# Altium schematic sheet SOM_BOOT.SchDoc
size 420 x 297 mm; SheetNumber: 8; SheetTotal: 19
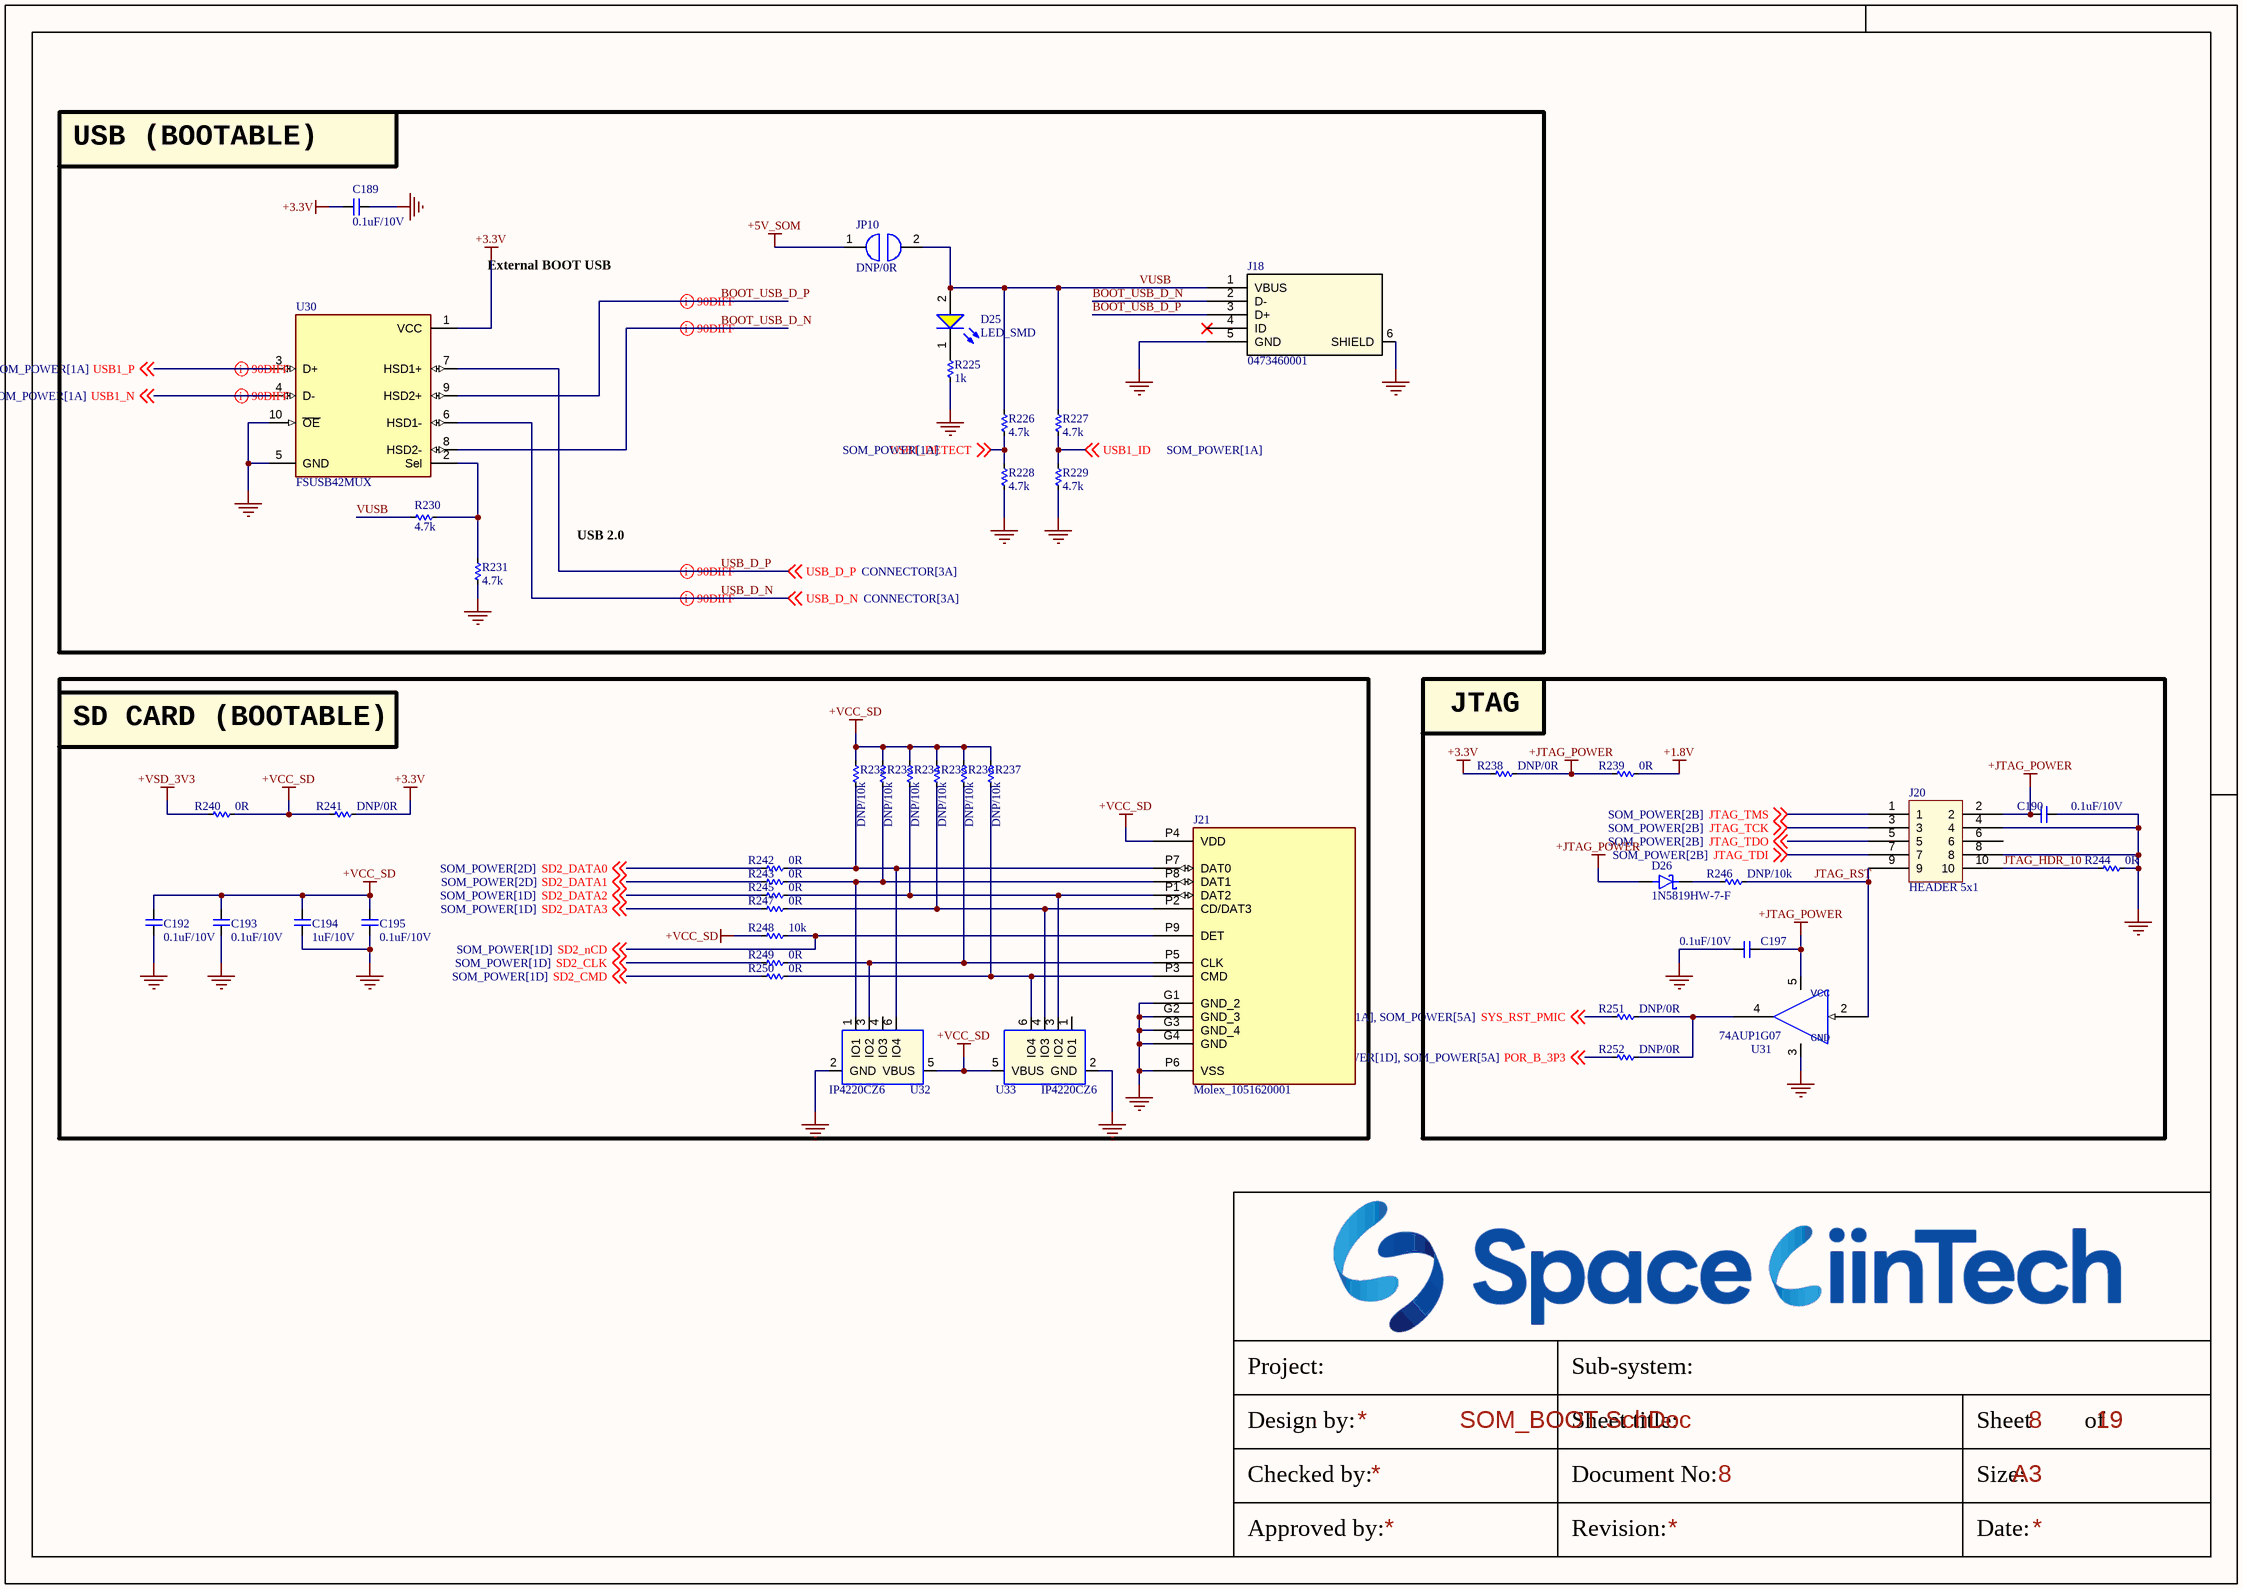
[diagram p0: SOM_BOOT.SchDoc]

## Parts
C189  0.1uF/10V  [CAP_C_1005X60]
C190  0.1uF/10V  [CAP_C_1005X60]
C192  0.1uF/10V  [CAP_C_1005X60]
C193  0.1uF/10V  [CAP_C_1005X60]
C194  1uF/10V  [CAP_C_1005X60]
C195  0.1uF/10V  [CAP_C_1005X60]
C197  0.1uF/10V  [CAP_C_1005X60]
D25  LED_SMD  [LED_0603]
D26  1N5819HW-7-F  [SOD3717X145N]
J18  0473460001  [47346-0001_MOL]
J20  HEADER 5x1  [CONN_54202-T0805ALF]
J21  Molex_1051620001  [Molex_1051620001]
JP10  DNP/0R  [RES_C_1608X60]
R225  1k  [RES_C_1005X40]
R226  4.7k  [RES_C_1005X40]
R227  4.7k  [RES_C_1005X40]
R228  4.7k  [RES_C_1005X40]
R229  4.7k  [RES_C_1005X40]
R230  4.7k  [RES_C_1005X40]
R231  4.7k  [RES_C_1005X40]
R232  DNP/10k  [RES_C_1005X40]
R233  DNP/10k  [RES_C_1005X40]
R234  DNP/10k  [RES_C_1005X40]
R235  DNP/10k  [RES_C_1005X40]
R236  DNP/10k  [RES_C_1005X40]
R237  DNP/10k  [RES_C_1005X40]
R238  DNP/0R  [RES_C_1005X40]
R239  0R  [RES_C_1005X40]
R240  0R  [RES_C_1005X40]
R241  DNP/0R  [RES_C_1005X40]
R242  0R  [RES_C_1005X40]
R243  0R  [RES_C_1005X40]
R244  0R  [RES_C_1005X40]
R245  0R  [RES_C_1005X40]
R246  DNP/10k  [RES_C_1005X40]
R247  0R  [RES_C_1005X40]
R248  10k  [RES_C_1005X40]
R249  0R  [RES_C_1005X40]
R250  0R  [RES_C_1005X40]
R251  DNP/0R  [RES_C_1005X40]
R252  DNP/0R  [RES_C_1005X40]
U30  FSUSB42MUX  [FP-846AP-MFG]
U31  74AUP1G07  [SOT-23-5_DIO]
U32  IP4220CZ6  [SOT95P280X145-6N]
U33  IP4220CZ6  [SOT95P280X145-6N]

## Blocks framed on the sheet
USB (BOOTABLE): C189 D25 J18 JP10 R225-R231 U30
SD CARD (BOOTABLE): C192-C195 J21 R232-R237 R240-R243 R245 R247-R250 U32 U33
JTAG: C190 C197 D26 J20 R238 R239 R244 R246 R251 R252 U31

## Nets
+1.8V: R239.1
+3.3V: C189.2 R238.2 R241.2 U30.1(VCC)
+5V_SOM: JP10.1
+JTAG_POWER: C190.2 C197.1 D26.2(A) J20.2 R238.1 R239.2 U31.5(VCC)
+VCC_SD: C192.2 C193.2 C194.2 C195.2 J21.P4(VDD) R232.2 R233.2 R234.2 R235.2 R236.2 R237.2 R240.2 R241.1 R248.1 U32.5(VBUS) U33.5(VBUS)
+VSD_3V3: R240.1
GND: C189.1 C190.1 C192.1 C193.1 C194.1 C195.1 C197.2 J18.5(GND) J18.6(SHIELD) J20.4 J20.8 J21.G1(GND_2) J21.G2(GND_3) J21.G3(GND_4) J21.G4(GND) J21.P6(VSS) R225.1 R228.1 R229.1 R231.1 R244.1 U30.5(GND) U30.10(~{OE}) U31.3(GND) U32.2(GND) U33.2(GND)
BOOT_USB_D_N: J18.2(D-) U30.8(HSD2-)
BOOT_USB_D_P: J18.3(D+) U30.9(HSD2+)
JTAG_HDR_10: J20.10 R244.2
JTAG_RST: J20.9 R246.1 U31.2(IN)
JTAG_TCK: J20.3 ; off-sheet JTAG_TCK
JTAG_TDI: J20.7 ; off-sheet JTAG_TDI
JTAG_TDO: J20.5 ; off-sheet JTAG_TDO
JTAG_TMS: J20.1 ; off-sheet JTAG_TMS
POR_B_3P3: R252.2 ; off-sheet POR_B_3P3
SD2_CLK: R249.1 ; off-sheet SD2_CLK
SD2_CMD: R250.1 ; off-sheet SD2_CMD
SD2_DATA0: R242.1 ; off-sheet SD2_DATA0
SD2_DATA1: R243.1 ; off-sheet SD2_DATA1
SD2_DATA2: R245.1 ; off-sheet SD2_DATA2
SD2_DATA3: R247.1 ; off-sheet SD2_DATA3
SD2_nCD: J21.P9(DET) R248.2 ; off-sheet SD2_nCD
SYS_RST_PMIC: R251.2 ; off-sheet SYS_RST_PMIC
USB1_DETECT: R226.1 R228.2 ; off-sheet USB1_DETECT
USB1_ID: R227.1 R229.2 ; off-sheet USB1_ID
USB1_N: U30.4(D-) ; off-sheet USB1_N
USB1_P: U30.3(D+) ; off-sheet USB1_P
USB_D_N: U30.6(HSD1-) ; off-sheet USB_D_N
USB_D_P: U30.7(HSD1+) ; off-sheet USB_D_P
VUSB: D25.2(A) J18.1(VBUS) JP10.2 R226.2 R227.2 R230.1
NetD25_1: D25.1(K) R225.2
NetD26_1: D26.1(K) R246.2
NetJ21_P1: J21.P1(DAT2) R234.1 R245.2 U33.3(IO2)
NetJ21_P2: J21.P2(CD/DAT3) R235.1 R247.2 U33.4(IO3)
NetJ21_P3: J21.P3(CMD) R237.1 R250.2 U33.6(IO4)
NetJ21_P5: J21.P5(CLK) R236.1 R249.2 U32.3(IO2)
NetJ21_P7: J21.P7(DAT0) R232.1 R242.2 U32.6(IO4)
NetJ21_P8: J21.P8(DAT1) R233.1 R243.2 U32.1(IO1)
NetR230_2: R230.2 R231.2 U30.2(Sel)
NetR251_1: R251.1 R252.1 U31.4(OUT)

Not connected (* = marked no-connect by the designer): J18 4(ID)*; J20 6; U32 4(IO3); U33 1(IO1)

## Layout directives
differential pair; differential pair class DIFF90: BOOT_USB_D_N, BOOT_USB_D_P, USB1_N, USB1_P, USB_D_N, USB_D_P

## Notes on the sheet
- External BOOT USB
- USB 2.0
- Project:
- Sub-system:
- Design by:
- Sheet title:
- Sheet
- of
- Checked by:
- Approved by:
- Revision:
- Document No:
- Size:
- Date:
- A3

## Library data of the parts
C189 C190 C192-C195 C197 = _CAP_C_2: CAP CHIP
D26 = DIODE SCHOTTKY: DIODE SCHOTTKY 40V 1A SOD123
J18 = USB_micro: No Description Available; Mfr_Name: Molex Connector Corporation; RefDes: RefDes; Type: Type
J20 = Header 5x2_Z
J21 = Molex_1051620001: 9 (8 + 1) Position Card Connector Secure Digital - microSDâ„¢ Surface Mount, Right Angle Gold; MF: Molex; SnapEDA_Link: https://www.snapeda.com/parts/1051620001/Molex/view-part/?ref=snap; Package: None; Value: *; MP: 1051620001; Check_prices: https://www.snapeda.com/parts/1051620001/Molex/view-part/?ref=eda
JP10 = JUMPER
R225-R252 = _RES_B_2: RES
U30 = CMP-07103-000004-1: IC USB SWITCH DPDT 10MSOP; Voltage: 4.3V; Current: 100mA; Number of Inputs: 2; Supply Type: Single; Number of Outputs: 4; Data Rate: 480Mbps; On-State Resistance: 6.5R; Min Supply Voltage: 3V; Package Quantity: 1; Length: 3mm; Radiation Hardening: No; Number of Pins: 10; Width: 3mm; Number of Channels: 2; REACH SVHC: No SVHC; Lead Free: Lead Free; Max Operating Temperature: 85°C; Min Operating Temperature: -40°C; Packaging: Tape and Reel; Throw Configuration: DPDT; Operating Supply Voltage: 4.3V; Max Supply Voltage: 4.3V; Mount: Surface Mount; Case/Package: MSOP; Weight: 0.1125g; Height: 0.85mm
U31 = 74AUP1G07 , buffer ,LV: P/N: 106D20071S; PCB Footprint: SC70; CLABCONF0: =SB-UCMIMX93
U32 U33 = IP4220CZ6_0: P/N: 132D42200S; PCB Footprint: SOT23-6L; CLABCONF0: =SB-UCMIMX93